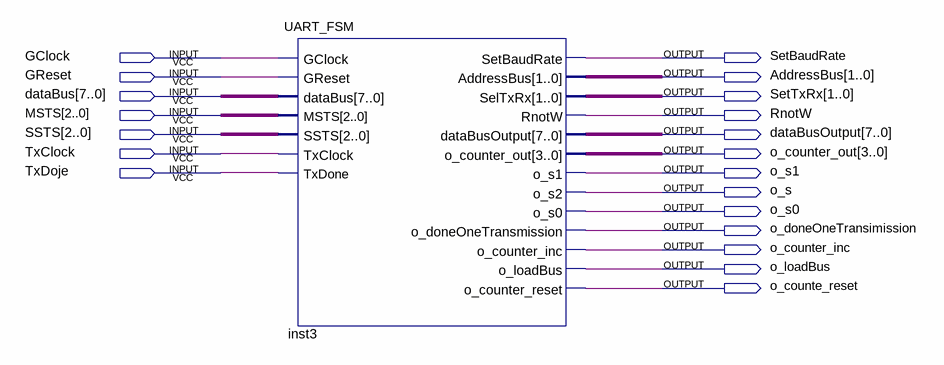
[diagram p0: schematic sheet]
// Quartus schematic testing.bdf as structural Verilog: 1 symbols, 20 pins
module testing (
  input  GClock,
  input  GReset,
  input  [7:0] dataBus,
  input  [2:0] MSTS,
  input  [2:0] SSTS,
  input  TxClock,
  input  TxDoje,
  output SetBaudRate,
  output [1:0] AddressBus,
  output [1:0] SetTxRx,
  output RnotW,
  output [7:0] dataBusOutput,
  output [3:0] o_counter_out,
  output o_s1,
  output o_s,
  output o_s0,
  output o_doneOneTransimission,
  output o_counter_inc,
  output o_loadBus,
  output o_counte_reset
);

  UART_FSM inst3 (
    .GClock(GClock), .GReset(GReset), .dataBus(dataBus), .MSTS(MSTS), .SSTS(SSTS), .TxClock(TxClock),
    .TxDone(TxDoje), .SetBaudRate(SetBaudRate), .AddressBus(AddressBus), .SelTxRx(SetTxRx), .RnotW(RnotW),
    .dataBusOutput(dataBusOutput), .o_counter_out(o_counter_out), .o_s1(o_s1), .o_s2(o_s), .o_s0(o_s0),
    .o_doneOneTransmission(o_doneOneTransimission), .o_counter_inc(o_counter_inc), .o_loadBus(o_loadBus),
    .o_counter_reset(o_counte_reset));
endmodule
